# Altium schematic sheet pi2pci.SchDoc
size A
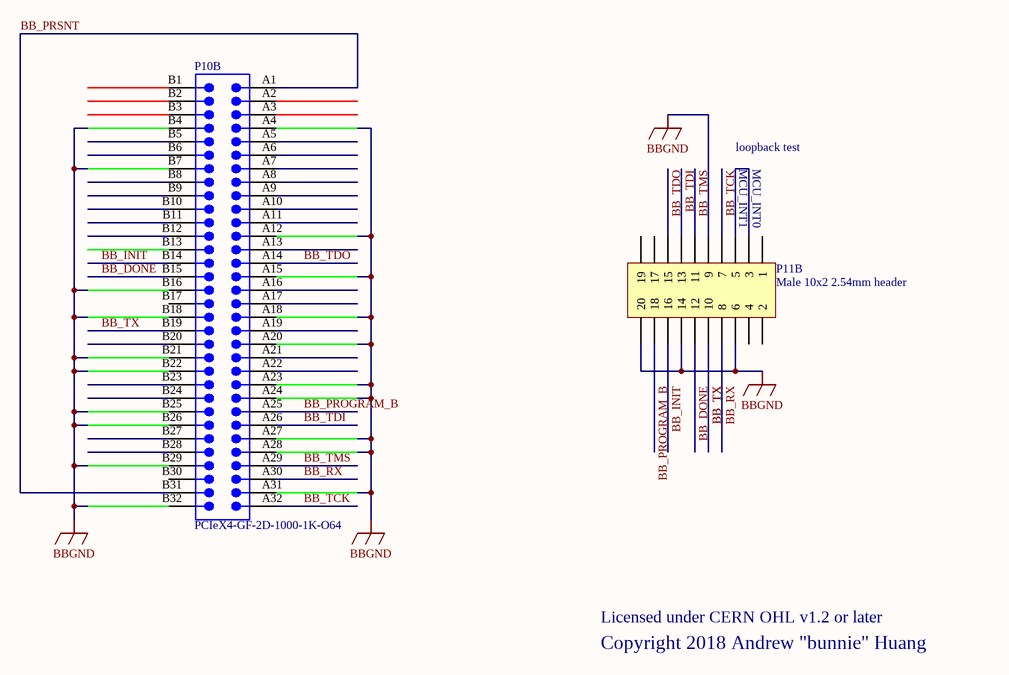
[diagram p0: pi2pci.SchDoc]

## Parts
P10B  PCIeX4-GF-2D-1000-1K-O64  [PCIeX4-GF-2D-1000-1K-O64]  (no BOM)
P11B  Male 10x2 2.54mm header  [HDR2X10]

## Nets
BBGND: P10B.A4 P10B.A12 P10B.A15 P10B.A18 P10B.A20 P10B.A23 P10B.A24 P10B.A27 P10B.A28 P10B.A31 P10B.B4 P10B.B7 P10B.B16 P10B.B18 P10B.B21 P10B.B22 P10B.B25 P10B.B26 P10B.B29 P10B.B32 P11B.6 P11B.9 P11B.14 P11B.20
BB_DONE: P10B.B15 P11B.12
BB_INIT: P10B.B14 P11B.16
BB_PROGRAM_B: P10B.A25 P11B.18
BB_PRSNT: P10B.A1 P10B.B31
BB_RX: P10B.A30 P11B.8
BB_TCK: P10B.A32 P11B.7
BB_TDI: P10B.A26 P11B.13
BB_TDO: P10B.A14 P11B.15
BB_TMS: P10B.A29 P11B.11
BB_TX: P10B.B19 P11B.10
NetP11B_3: P11B.3 P11B.5

Not connected (* = marked no-connect by the designer): P10B A2 A3 A5 A6 A7 A8 A9 A10 A11 A13 A16 A17 A19 A21 A22 B1 B2 B3 B5 B6 B8 B9 B10 B11 B12 B13 B17 B20 B23 B24 B27 B28 B30; P11B 1 2 4 17 19

## Notes on the sheet
- loopback test
- (near P11B) MCU_INT1
- (near P11B) MCU_INT0
- Licensed under CERN OHL v1.2 or later
- Copyright 2018 Andrew "bunnie" Huang

## Library data of the parts
P10B = CMP-0001-00031-1: Golden finger, PCIeX4, Dual, Opposite, Pitch 1mm, 64-Position; Mating Connector: Molex-87715-9106; Datasheet Version: rev2.0, Apr-2007; Package Reference: PCIeX4-GF-2D-1000-1K-O64; ClassName: Edge Connector; Publisher: Altium
P11B = Header 10X2: Header, 10-Pin, Dual row; MPN: CP25412-020-G116-A; VENDOR: KAWAEEI; MYPN: J-2x20-2.54-MALE; LatestRevisionDate: 17-Jul-2002; LatestRevisionNote: Re-released for DXP Platform.; Publisher: Altium Limited